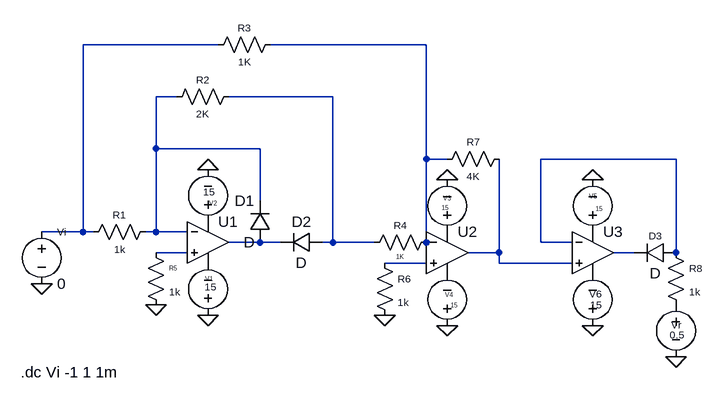
[diagram p0: schematic 2017AAPS1734H_Run5.asc]
2017AAPS1734H_Run5.asc, the LTspice schematic file:
Version 4
SHEET 1 920 680
WIRE 96 -176 -112 -176
WIRE 416 -176 176 -176
WIRE 32 -96 0 -96
WIRE 272 -96 112 -96
WIRE 0 -16 0 -96
WIRE 160 -16 0 -16
WIRE 416 0 416 -176
WIRE 448 0 416 0
WIRE 800 0 592 0
WIRE 160 64 160 -16
WIRE -112 112 -112 -176
WIRE -112 112 -176 112
WIRE -96 112 -112 112
WIRE 0 112 0 -16
WIRE 0 112 -16 112
WIRE 48 112 0 112
WIRE 160 128 112 128
WIRE 192 128 160 128
WIRE 272 128 272 -96
WIRE 272 128 256 128
WIRE 336 128 272 128
WIRE 416 128 416 0
WIRE 592 128 592 0
WIRE 640 128 592 128
WIRE 48 144 0 144
WIRE 528 144 528 0
WIRE 528 144 480 144
WIRE 736 144 704 144
WIRE 800 144 800 0
WIRE 416 160 352 160
WIRE 528 160 528 144
WIRE 640 160 528 160
FLAG -176 192 0
FLAG 80 240 0
FLAG 80 16 0
FLAG 448 256 0
FLAG 448 32 0
FLAG 352 240 0
FLAG 672 32 0
FLAG 672 256 0
FLAG 0 224 0
FLAG 800 304 0
SYMBOL Opamps\\UniversalOpamp2 80 128 R0
SYMATTR InstName U1
SYMBOL Opamps\\UniversalOpamp2 448 144 R0
SYMATTR InstName U2
SYMBOL Opamps\\UniversalOpamp2 672 144 R0
SYMATTR InstName U3
SYMBOL diode 176 128 R180
WINDOW 0 24 64 Left 2
WINDOW 3 24 0 Left 2
SYMATTR InstName D1
SYMBOL diode 256 112 R90
WINDOW 0 0 32 VBottom 2
WINDOW 3 32 32 VTop 2
SYMATTR InstName D2
SYMBOL voltage 80 256 R180
WINDOW 0 -8 72 Left 0
WINDOW 3 -13 60 Left 1
SYMATTR InstName V1
SYMATTR Value 15
SYMBOL voltage 80 112 R180
WINDOW 0 -14 44 Left 0
WINDOW 3 -11 62 Left 1
SYMATTR InstName V2
SYMATTR Value 15
SYMBOL voltage 448 128 R180
WINDOW 0 -6 68 Left 0
WINDOW 3 -3 53 Left 0
WINDOW 123 0 0 Left 0
WINDOW 39 0 0 Left 0
SYMATTR InstName V3
SYMATTR Value 15
SYMBOL voltage 448 272 R180
WINDOW 0 -9 63 Left 0
WINDOW 3 -17 47 Left 0
SYMATTR InstName V4
SYMATTR Value 15
SYMBOL voltage 672 128 R180
WINDOW 0 -7 71 Left 0
WINDOW 3 -16 52 Left 0
SYMATTR InstName V5
SYMATTR Value 15
SYMBOL voltage 672 272 R180
WINDOW 0 -14 65 Left 1
WINDOW 3 -14 48 Left 1
SYMATTR InstName V6
SYMATTR Value 15
SYMBOL voltage -176 96 R0
WINDOW 0 24 16 Left 1
WINDOW 123 0 0 Left 0
WINDOW 39 0 0 Left 0
SYMATTR InstName Vi
SYMATTR Value 0
SYMBOL res 0 96 R90
WINDOW 0 0 56 VBottom 1
WINDOW 3 32 56 VTop 1
SYMATTR InstName R1
SYMATTR Value 1k
SYMBOL res 128 -112 R90
WINDOW 0 0 56 VBottom 1
WINDOW 3 32 56 VTop 1
SYMATTR InstName R2
SYMATTR Value 2K
SYMBOL res 192 -192 R90
WINDOW 0 0 56 VBottom 1
WINDOW 3 32 56 VTop 1
SYMATTR InstName R3
SYMATTR Value 1K
SYMBOL res 432 112 R90
WINDOW 0 0 56 VBottom 1
WINDOW 3 32 56 VTop 0
SYMATTR InstName R4
SYMATTR Value 1K
SYMBOL res -16 128 R0
WINDOW 0 36 40 Left 0
WINDOW 3 36 76 Left 1
SYMATTR InstName R5
SYMATTR Value 1k
SYMBOL res 336 144 R0
WINDOW 0 36 40 Left 1
WINDOW 3 36 76 Left 1
SYMATTR InstName R6
SYMATTR Value 1k
SYMBOL res 544 -16 R90
WINDOW 0 0 56 VBottom 1
WINDOW 3 32 56 VTop 1
SYMATTR InstName R7
SYMATTR Value 4K
SYMBOL res 784 128 R0
WINDOW 0 36 40 Left 1
WINDOW 3 36 76 Left 1
SYMATTR InstName R8
SYMATTR Value 1k
SYMBOL voltage 800 208 R0
WINDOW 0 -7 47 Left 1
WINDOW 3 -10 62 Left 1
SYMATTR InstName Vr
SYMATTR Value 0.5
SYMBOL diode 800 128 R90
WINDOW 0 0 32 VBottom 1
WINDOW 3 32 32 VTop 2
SYMATTR InstName D3
TEXT -208 328 Left 2 !.dc Vi -1 1 1m

The netlist it stands for:
* 2017AAPS1734H_Run5.asc
XU1 N007 N003 P001 P002 N006 level.2 Avol=1Meg GBW=10Meg Slew=10Meg ilimit=25m rail=0 Vos=0 phimargin=45 en=0 enk=0 in=0 ink=0 Rin=500Meg  ; pins IN+ IN- V+ V- OUT
XU2 N010 N002 P003 P004 N008 level.2 Avol=1Meg GBW=10Meg Slew=10Meg ilimit=25m rail=0 Vos=0 phimargin=45 en=0 enk=0 in=0 ink=0 Rin=500Meg  ; pins IN+ IN- V+ V- OUT
XU3 N008 N005 P005 P006 N009 level.2 Avol=1Meg GBW=10Meg Slew=10Meg ilimit=25m rail=0 Vos=0 phimargin=45 en=0 enk=0 in=0 ink=0 Rin=500Meg  ; pins IN+ IN- V+ V- OUT
D1 N006 N003 D
D2 N004 N006 D
V1 0 P002 15
V2 P001 0 15
V3 P003 0 15
V4 0 P004 15
V5 P005 0 15
V6 0 P006 15
Vi N001 0 0
R1 N003 N001 1k
R2 N004 N003 2K
R3 N002 N001 1K
R4 N002 N004 1K
R5 N007 0 1k
R6 N010 0 1k
R7 N008 N002 4K
R8 N005 P007 1k
Vr P007 0 0.5
D3 N005 N009 D
.model D D
.lib standard.dio
.dc Vi -1 1 1m
.lib UniversalOpamps2.sub
.backanno
.end